# Altium schematic sheet SensorCaida.SchDoc
size A4
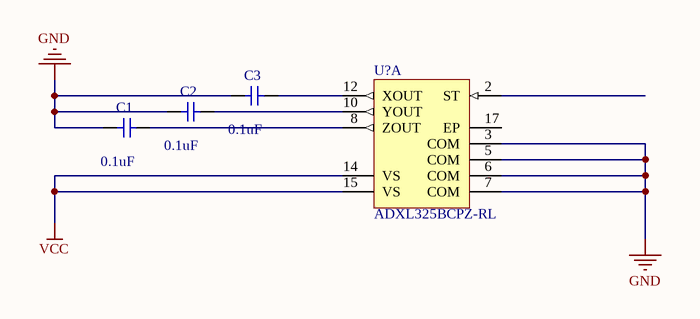
[diagram p0: SensorCaida.SchDoc]

## Parts
C1  value 0.1uF  [C1206-1.00]  (hidden comment: C)
C2  value 0.1uF  [C1206-1.00]  (hidden comment: C)
C3  value 0.1uF  [C1206-1.00]  (hidden comment: C)
U?  ADXL325BCPZ-RL  [ADI-CP-16-5a_N]  (part A of 2)

## Nets
GND: C2.2 C3.2 U?.3(COM) U?.5(COM) U?.6(COM) U?.7(COM)
VCC: U?.14(VS) U?.15(VS)
NetC1_1: C1.1 U?.8(ZOUT)
NetC2_1: C2.1 U?.10(YOUT)
NetC3_1: C3.1 U?.12(XOUT)

Not connected (* = marked no-connect by the designer): C1 2; U? 2(ST) 17(EP)

## Library data of the parts
C1-C3 = C: Capacitor, generic
U? = ADXL325BCPZ-RL: Small, Low Power, 3-Axis +/-5 g Accelerometer with Analog Output, 1.6 KHz BW, Industrial, 16-pin QFN, Reel; Manufacturer: Analog Devices; # of Axes: 3; -3dB Bandwidth: 1.6 KHz; Sensitivity: 174 mV/g; Supply Current: 350 uA; Voltage Supply (V): 1.8 to 3.6; DatasheetVersion: Rev. 0; PackageVersion: 072606-0, 07/2006; PackageReference: CP-16-5a; PackageDescription: 16-Pin Lead Frame Chip Scale Package, 4 x 4 mm Body, 0.65 mm Pitch; Supplier 1: Digi-Key; Supplier Part Number 1: ADXL325BCPZ-RL-ND; Supplier 2: Mouser; Supplier Part Number 2: 584-ADXL325BCPZ-R; Output Type: Analog; Packing: Reel; Mounting Technology: Surface Mount; PartNumber: ADXL325BCPZ-RL; ComponentLink1Description: Manufacturer URL; ComponentLink1URL: http://www.analog.com/en/index.html; ComponentLink2Description: Datasheet; ComponentLink2URL: http://www.analog.com/static/imported-files/data_sheets/ADXL325.pdf; ComponentLink3Description: Package Specification; ComponentLink3URL: http:/www.analog.com/static/imported-files/packages/45789401034275374892178CP_16_5a.pdf; ComponentLink4Description: Product URL; ComponentLink4URL: http://www.analog.com/en/mems-sensors/mems-inertial-sensors/adxl325/products/product.html